# Altium schematic sheet voeding.SchDoc
size A4; SheetNumber: 3; SheetTotal: 5; SPICEModelCacheGXGOSBFP: <root> / <DocumentId>GXGOSBFP</DocumentId> / <CacheFrame Number="0"> / <Model Name="1n4007" Kind="MDL"> / <Text>*1N4007 MCE 8-16-95 / *1000V 1A Si GenPurpose Diode pkg:DIODE0.4 1,2 / .MODEL 1N4007 D(IS=2.55E-9 RS=0.042 N=1.75 TT=5.76E-6 CJO=1.85E-11 / + VJ=0.75 M=0.333 BV=1000 IBV=9.86E-5 )</Text> / </Model> / </CacheFrame> / </root>
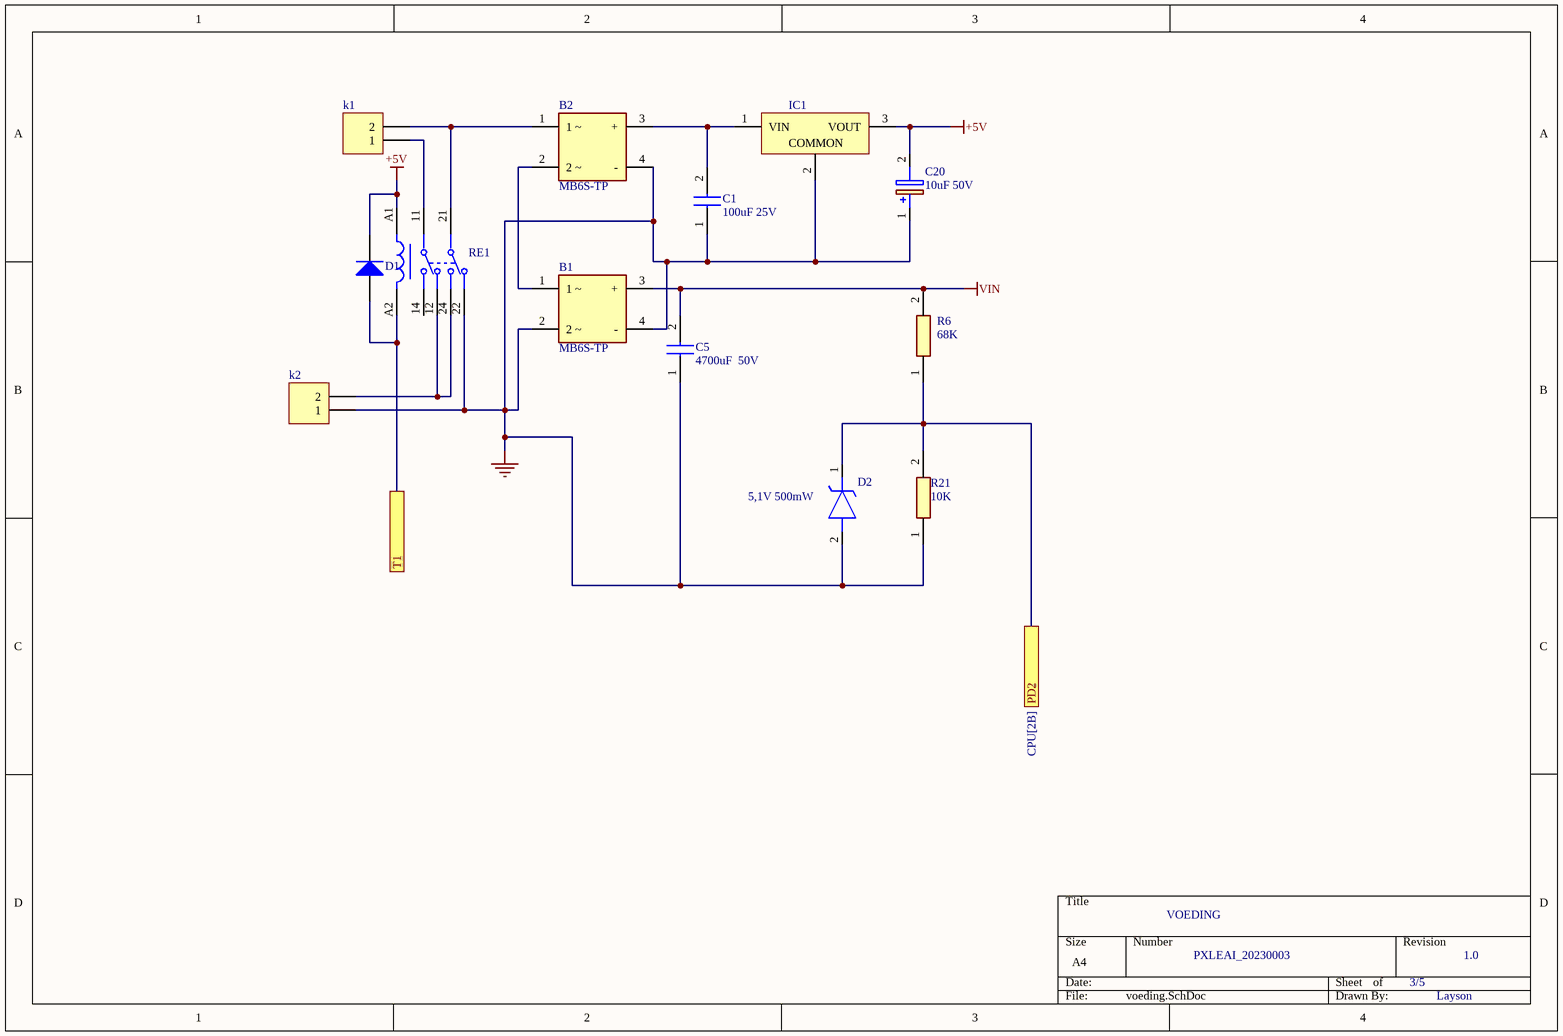
[diagram p0: voeding.SchDoc]

## Parts
B1  MB6S-TP  [FP-MBS-1-MFG]
B2  MB6S-TP  [FP-MBS-1-MFG]
C1  100uF 25V  [MCGPR25V107M6.3X11]
C5  4700uF  50V  [CAPPRD1000W82D2250H4300]
C20  10uF 50V  [CAPPRD200W52D525H1200]
D1  Diode 1N4007  [DO-41]  (value not drawn)
D2  5,1V 500mW  [DIOM5226X240N]
IC1  OKI-78SR-5/1.5-W36-C  [MURA-OKI-78SR-3]  (value not drawn)
k1  Header 2  [HDR1X2]  (value not drawn)
k2  Header 2  [HDR1X2]  (value not drawn)
R6  68K  [RESC2012X60N]
R21  10K  [RESC2012X65N]
RE1  RT424005F  [FP-RT424005F-MFG]  (value not drawn)

## Ports
PD2 (see CPU[2B]), T1 (see CPU[1B])

## Nets
+5V: C20.2(-) D1.2(K) IC1.3(VOUT) RE1.A1
GND: B1.2(2_~) B1.4(-) B2.4(-) C1.1(+) C5.1(+) C20.1(+) D2.2(A) IC1.2(COMMON) k2.1 R21.1 RE1.22
VIN: B1.3(+) C5.2(-) R6.2
PD2: D2.1(K) R6.1 R21.2 ; port PD2
T1: D1.1(A) RE1.A2 ; port T1
NetB1_1: B1.1(1_~) B2.2(2_~)
NetB2_1: B2.1(1_~) k1.2 RE1.21
NetB2_3: B2.3(+) C1.2(-) IC1.1(VIN)
Netk1_1: k1.1 RE1.11
Netk2_2: k2.2 RE1.12 RE1.24

Not connected (* = marked no-connect by the designer): RE1 14

## Notes on the sheet
- VOEDING
- PXLEAI_20230003
- 3/5
- 1.0
- Layson

## Library data of the parts
B1 B2 = CMP-56207-000002-1: BRIDGE RECT 1P 600V 500MA MBS-1; Manufacturer: MCC; Value: 13pF; Max Surge Forward Current: 35A; Standoff Height: 0.05mm; Max Junction Temp: +150°C; Forward Current: 0.5A; Peak Reverse Current: 5uA; Temperature: -55°C to +150°C; Temperature Range High: +150°C; Package: MBS-1; Temperature Range Low: -55°C; Octopart: https://octopart.com/mb6s-tp-mcc-733391; Max Repetitive Reverse Voltage: 600V; Mouser Description: Bridge Rectifiers .5A 600V; ComponentLink2URL: https://www.mccsemi.com/pdf/Products/MB05S-MB10S(MBS-1)-H.pdf; Reverse Voltage: 600V; ComponentLink2Description: Datasheet; Height: 2.9mm; Manufacturer Part Number: MB6S-TP; Lead Free: Yes; RoHS: TRUE; Category: Diode; Device Class L2: Diodes; Digikey Description: BRIDGE RECT 1P 600V 500MA MBS-1; Device Class L1: Discrete Semiconductors; Automotive: No; Device Class L3: Rectifier Diodes; Capacitance: 13pF
C1 = MCGPR25V107M6.3X11: Capacitor / MCGPR25V107M6.3X11; Manufacturer_Name: MULTICOMP; Datasheet Link: http://www.farnell.com/datasheets/1723232.pdf; Manufacturer_Part_Number: MCGPR25V107M6.3X11
C5 = MCGPR50V478M22X41: Capacitor / MCGPR50V478M22X41; Manufacturer_Name: MULTICOMP; Datasheet Link: https://componentsearchengine.com/Datasheets/2/MCGPR50V478M22X41.pdf; Height: 43mm; Manufacturer_Part_Number: MCGPR50V478M22X41
C20 = MCGPR50V106M5X11: Capacitor Polarised / MCGPR50V106M5X11; Manufacturer_Name: MULTICOMP; Datasheet Link: https://www.farnell.com/datasheets/2861351.pdf; Height: 12mm; Manufacturer_Part_Number: MCGPR50V106M5X11
D1 = Diode 1N4007: 1 Amp General Purpose Rectifier; Published: 8-Jun-2000; LatestRevisionDate: 17-Jul-2002; LatestRevisionNote: Re-released for DXP Platform.; DatasheetVersion: 1998; PackageVersion: Aug-1999; PackageReference: DO-41; Publisher: Altium Limited; PackageDescription: Diode, Axial; Body 5.2 x 2.7 mm (LxDia. max), Lead Dia. 0.86 mm (max); Code_JEDEC: DO-204-AL; ComponentLink1Description: Manufacturer Link; ComponentLink1URL: http://www.fairchildsemi.com/; ComponentLink2Description: Datasheet; ComponentLink2URL: http://www.fairchildsemi.com/ds/1N%2F1N4001.pdf
D2 = SMAZ5V1-13-F: Zener Diode / SMAZ5V1-13-F; Manufacturer_Name: Diodes Inc.; Datasheet Link: https://componentsearchengine.com/Datasheets/2/SMAZ5V1-13-F.pdf; Height: 2.4mm; Manufacturer_Part_Number: SMAZ5V1-13-F; Mouser Part Number: 621-SMAZ5V1-F; Mouser Price/Stock: https://www.mouser.co.uk/ProductDetail/Diodes-Incorporated/SMAZ5V1-13-F?qs=S1c9RlDvu%252BxZqL2mgQBPYg%3D%3D; Arrow Part Number: SMAZ5V1-13-F; Arrow Price/Stock: https://www.arrow.com/en/products/smaz5v1-13-f/diodes-incorporated
IC1 = CMP-2000-05274-1: Non-Isolated DC/DC Converter, 7.5 W, 7 to 36 V, 1.5 A, -40 to 85 degC, 3-Pin THD, RoHS; Manufacturer: Murata; Current - Output (Max): 1.5A; Power (Watts) - Max: 8W; Efficiency: 90.5%; Voltage - Input (Min): 7V; Voltage - Input (Max): 36V; Voltage - Output 1: 5V; Number of Outputs: 1; Package / Case: 3-SIPModule; Features: SCP; Type: LinearRegulatorReplacement; Size / Dimension: 0.41"Lx0.30"Wx0.65"H(10.4mmx7.6mmx16.5mm); Datasheet URL: https://datasheet.ciiva.com/8006/1790439-8006672.pdf; Datasheet Version: Oct-13; Power (Watts) - Manufacture Series: 8W; Voltage - Output 2: -; Series: Okami™OKI-78SR; Family: DCDCConverters; Manufacturer URL: http://www.murata.com/; Category: PowerSupplies-BoardMount; Voltage - Isolation: -; Packaging: Tube; Applications: ITE(Commercial); Mounting Type: ThroughHole; Voltage - Output 3: -; Operating Temperature: -40degC~85degC
k1 k2 = Header 2: Header, 2-Pin; LatestRevisionDate: 17-Jul-2002; LatestRevisionNote: Re-released for DXP Platform.; Publisher: Altium Limited
R6 = CR0805-FX-6802GLF: Resistor / CR0805-FX-6802GLF; Manufacturer_Name: Bourns; Datasheet Link: https://www.bourns.com/pdfs/chpreztr.pdf; Height: 0.6mm; Manufacturer_Part_Number: CR0805-FX-6802GLF; Mouser Part Number: 652-CR0805-FX6802GLF; Mouser Price/Stock: https://www.mouser.com/Search/Refine.aspx?Keyword=652-CR0805-FX6802GLF
R21 = CPF0805B10KE: Resistor / CPF0805B10KE; Manufacturer_Name: TE Connectivity; Datasheet Link: http://docs-europe.electrocomponents.com/webdocs/13d1/0900766b813d116f.pdf; Height: 0.65mm; Manufacturer_Part_Number: CPF0805B10KE; Mouser Part Number: 279-CPF0805B10KE; Mouser Price/Stock: https://www.mouser.co.uk/ProductDetail/TE-Connectivity-Holsworthy/CPF0805B10KE?qs=DfH2yQaBz6uvLuHVBjZd2Q%3D%3D; Arrow Part Number: CPF0805B10KE; Arrow Price/Stock: https://www.arrow.com/en/products/cpf0805b10ke/te-connectivity?region=nac
RE1 = CMP-03395-000296-1: RELAY GENERAL PURPOSE DPDT 8A 5V; Power Consumption: 400mW; Coil Current: 80.6mA; Max Voltage Rating (AC): 400V; Coil Power: 500mW; Dropout Voltage: 500mV; Operate Time: 7ms; Contact Voltage Rating (AC): 250V; Coil Type: Non-Latching; Coil Resistance: 62R; Release Time: 3ms; Max Operating Temperature: 85°C; Package Quantity: 5000; Relay Type: General Purpose; Series: RT2; Lead Free: Lead Free; Coil Voltage (DC): 5V; Contact Current Rating: 8A; Packaging: Carton; Height: 15.7mm; Mount: Through Hole; Width: 12.7mm; ELV: Compliant; Termination: PCB; Contact Material: Silver; Throw Configuration: DPDT; Min Operating Temperature: -40°C; Weight: 13g; RoHS Compliant: Yes; Length: 29mm; Radiation Hardening: No